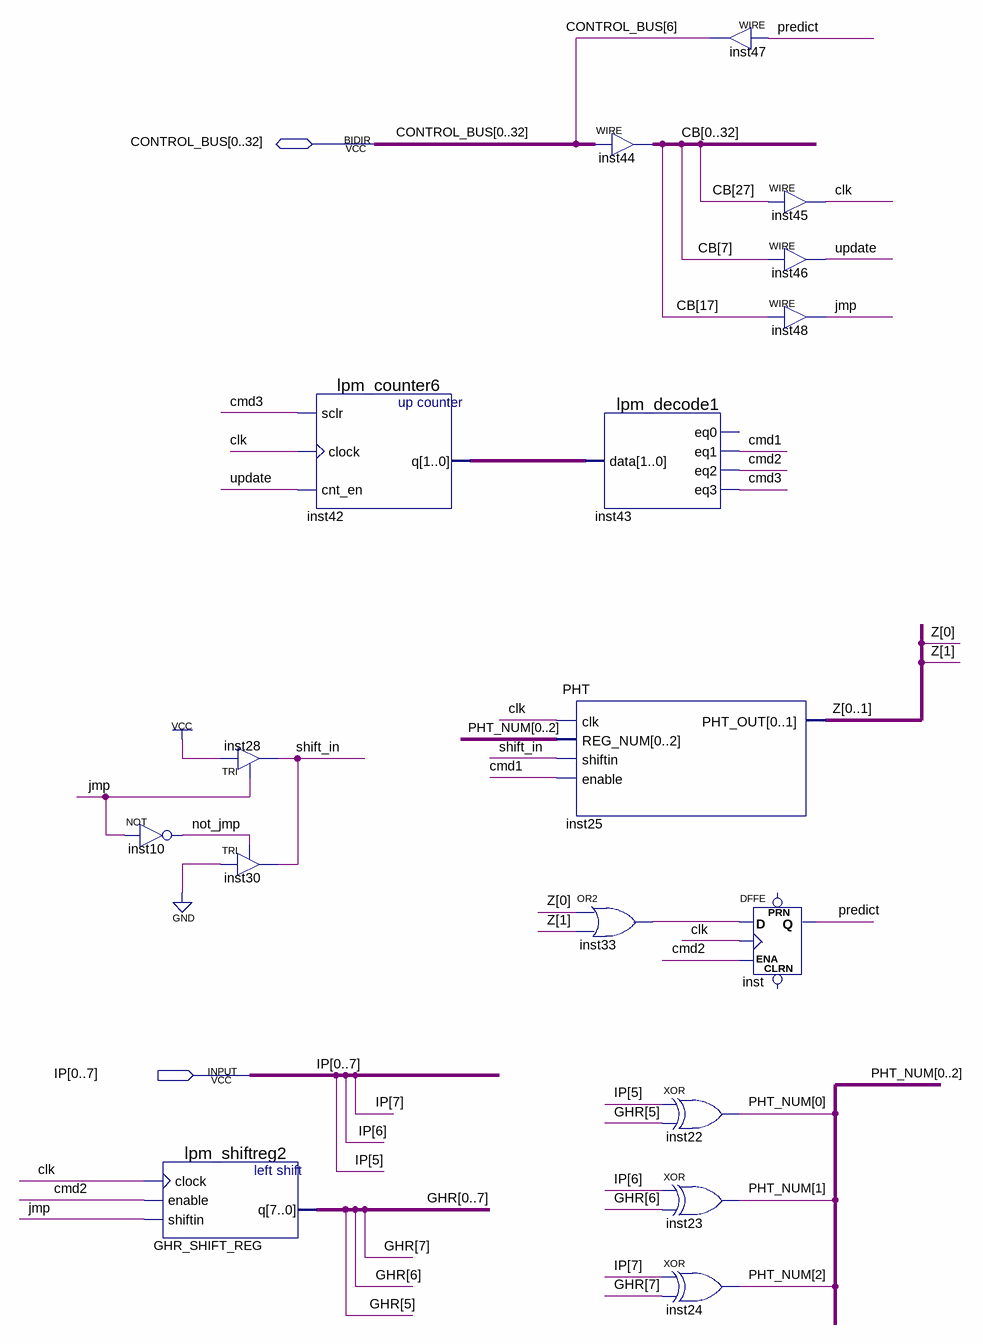
[diagram p0: schematic sheet]
// Quartus schematic predictor.bdf as structural Verilog: 17 symbols, 2 pins
module predictor (
  input  [0:7] IP,
  inout  [0:32] CONTROL_BUS
);

  wire clk, cmd1, cmd2, cmd3, inst33_out, jmp, not_jmp, predict, shift_in, update;
  wire [1:0] inst42_q, Z;
  wire [2:0] PHT_NUM;
  wire [7:0] GHR;
  wire [32:0] CB;

  not inst10 (not_jmp, jmp);
  lpm_shiftreg2 GHR_SHIFT_REG (
    .clock(clk), .enable(cmd2), .shiftin(jmp),
    .q({GHR[0], GHR[1], GHR[2], GHR[3], GHR[4], GHR[5], GHR[6], GHR[7]}));
  TRI inst28 (.IN(1'b1), .OE(jmp), .OUT(shift_in));
  TRI inst30 (.IN(1'b0), .OE(not_jmp), .OUT(shift_in));
  lpm_counter6 inst42 (.sclr(cmd3), .clock(clk), .cnt_en(update), .q(inst42_q));
  PHT inst25 (
    .clk(clk), .REG_NUM({PHT_NUM[0], PHT_NUM[1], PHT_NUM[2]}), .shiftin(shift_in), .enable(cmd1),
    .PHT_OUT({Z[0], Z[1]}));
  assign {CB[0], CB[1], CB[2], CB[3], CB[4], CB[5], CB[6], CB[7], CB[8], CB[9], CB[10], CB[11], CB[12], CB[13], CB[14], CB[15], CB[16], CB[17], CB[18], CB[19], CB[20], CB[21], CB[22], CB[23], CB[24], CB[25], CB[26], CB[27], CB[28], CB[29], CB[30], CB[31], CB[32]} = CONTROL_BUS;  // WIRE inst44
  lpm_decode1 inst43 (.data(inst42_q), .eq1(cmd1), .eq2(cmd2), .eq3(cmd3));  // open: eq0
  or inst33 (inst33_out, Z[0], Z[1]);
  assign CONTROL_BUS[6] = predict;  // WIRE inst47
  xor inst22 (PHT_NUM[0], IP[5], GHR[5]);
  xor inst23 (PHT_NUM[1], IP[6], GHR[6]);
  xor inst24 (PHT_NUM[2], IP[7], GHR[7]);
  assign clk = CB[27];  // WIRE inst45
  assign update = CB[7];  // WIRE inst46
  assign jmp = CB[17];  // WIRE inst48
  DFFE inst (.D(inst33_out), .CLK(clk), .ENA(cmd2), .Q(predict));  // open: PRN, CLRN
endmodule
